# EAGLE design relay_board (EAGLE 6.6.0)
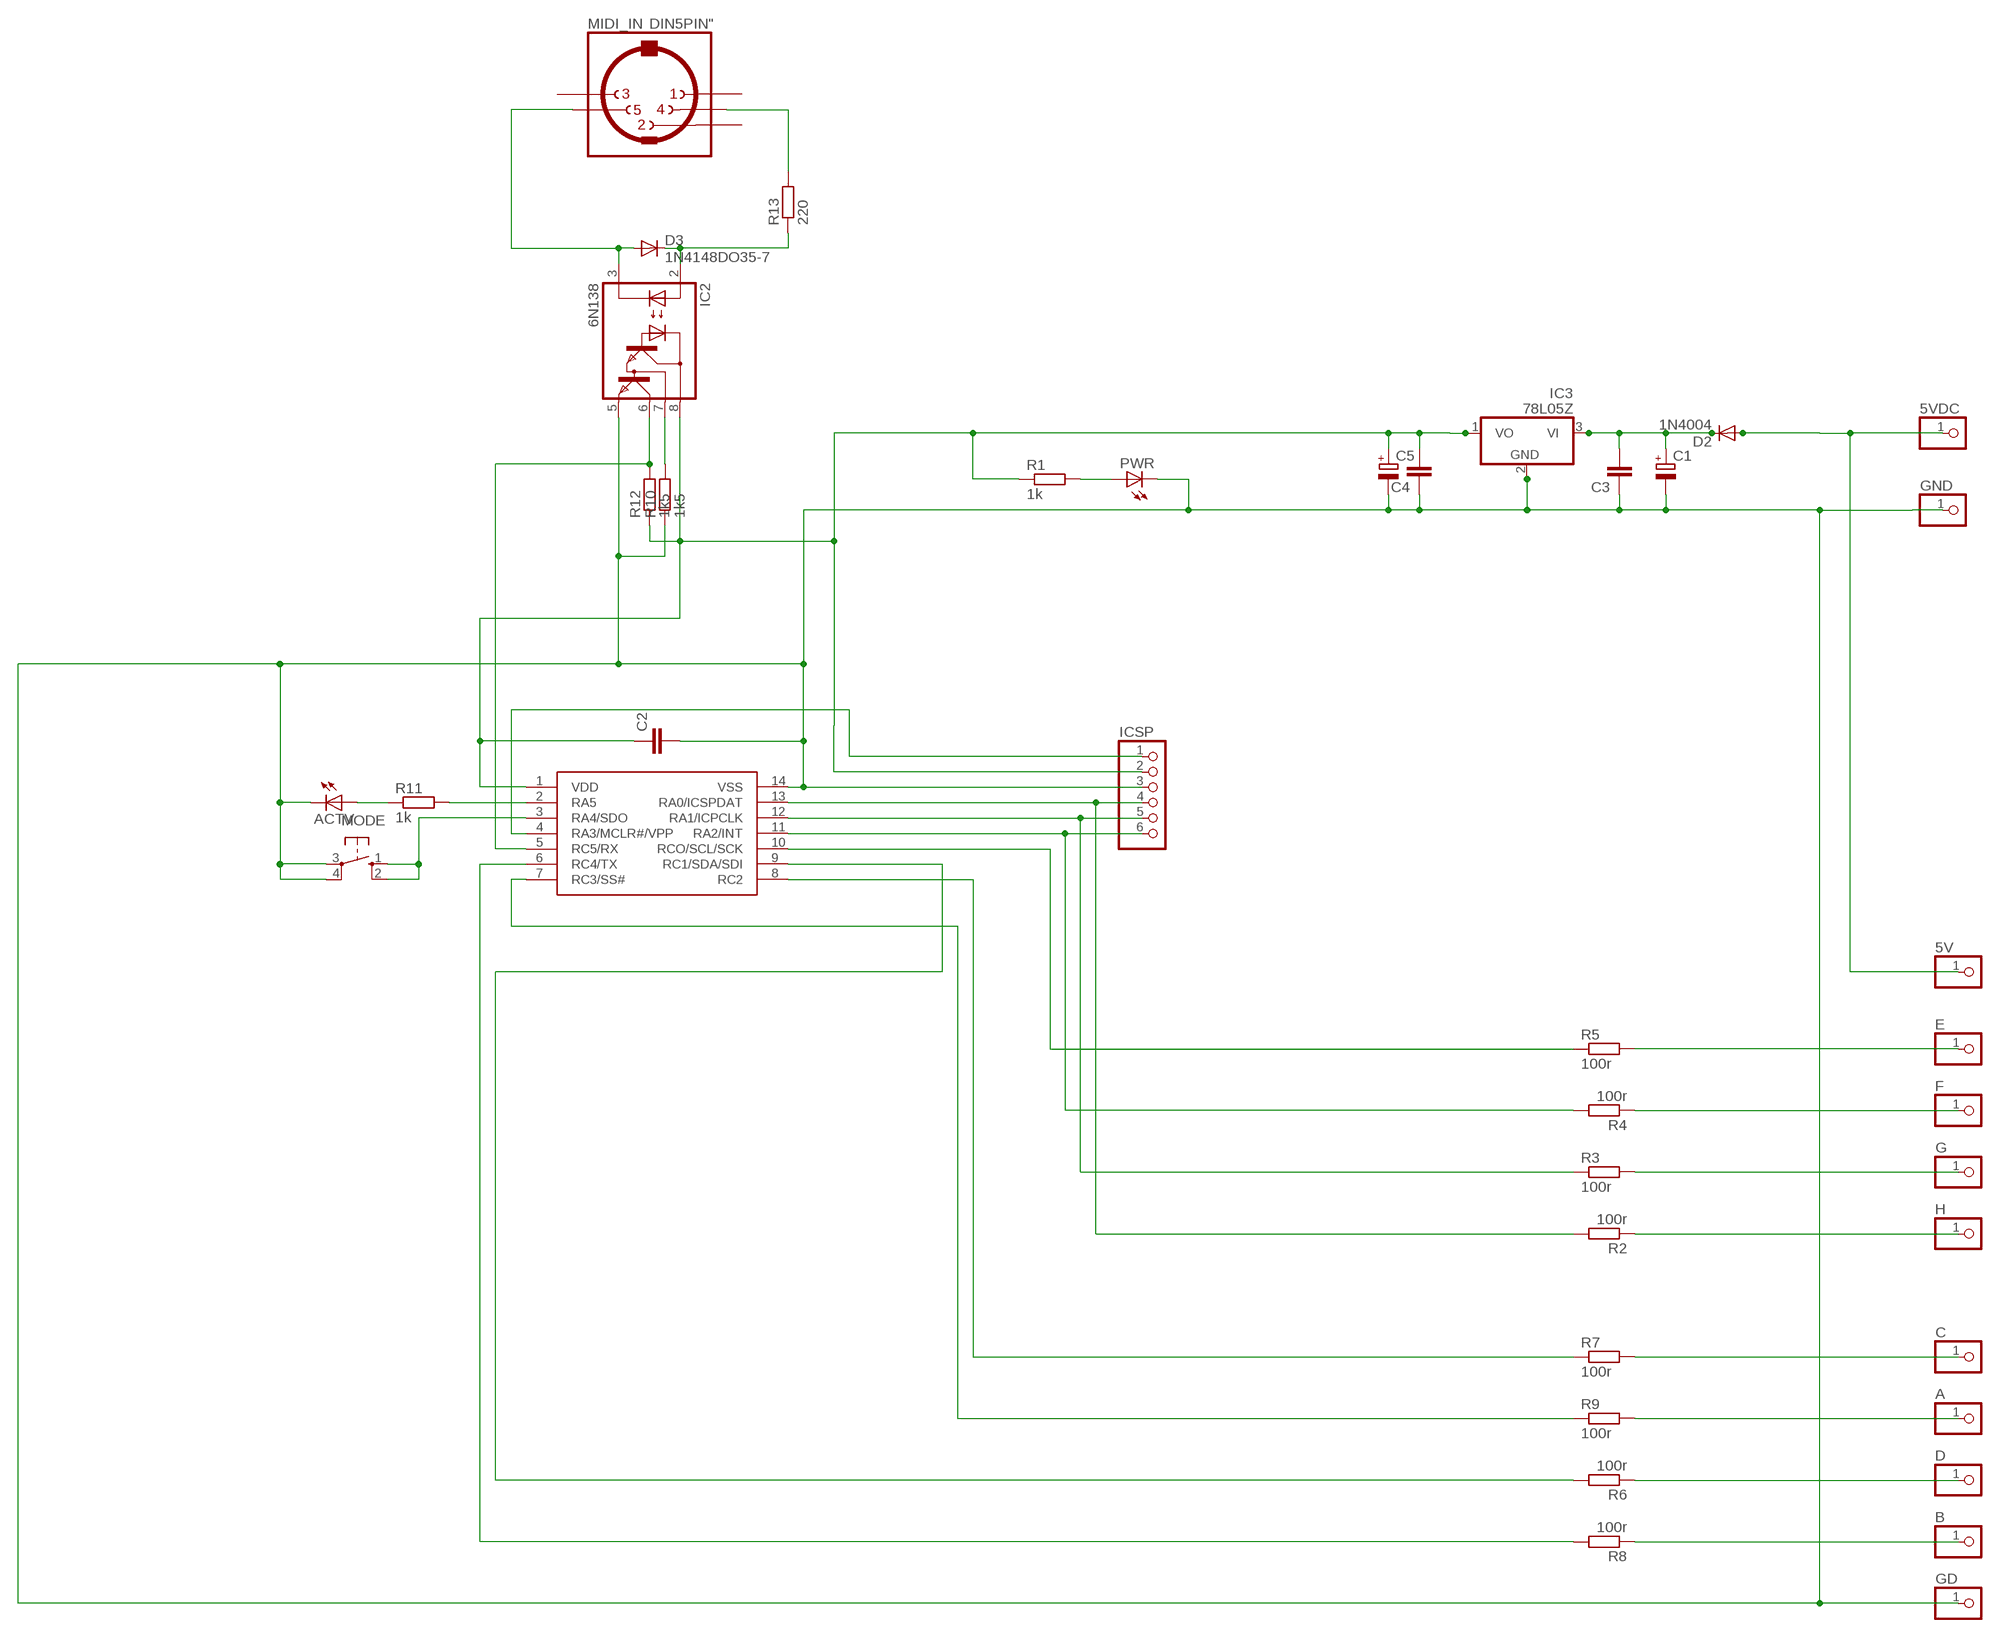
[diagram p0: schematic, sheet 1]

## Parts
5V  PINHD-1X1  [1X01]
5VDC  PINHD-1X1  [1X01]
A  PINHD-1X1  [1X01]
ACTV  LED3MM  [LED3MM]
B  PINHD-1X1  [1X01]
C  PINHD-1X1  [1X01]
C1  CPOL-EUE2.5-7  [E2,5-7]
C2  C2.5/2  [C2.5-2]
C3  C2.5/2  [C2.5-2]
C4  C2.5/2  [C2.5-2]
C5  CPOL-EUE2-5  [E2-5]
D  PINHD-1X1  [1X01]
D2  1N4004  [DO-VERT]
D3  1N4148DO35-7  [DO35-7]
E  PINHD-1X1  [1X01]
F  PINHD-1X1  [1X01]
G  PINHD-1X1  [1X01]
GD  PINHD-1X1  [1X01]
GND  PINHD-1X1  [1X01]
H  PINHD-1X1  [1X01]
IC1  PIC16F1825DIL14  [DIL14]
IC2  6N138  [DIL08]
IC3  78L05Z  [TO92]
ICSP  HEADER-1X6  [1X06_OVAL]
MIDI_IN  DIN5PIN"  [TRUCONN90]
MODE  10-XX  [B3F-10XX]
PWR  LED3MM  [LED3MM]
R1  1k  R-EU_0207/2V  [0207/2V]
R2  100r  R-EU_0207/2V  [0207/2V]
R3  100r  R-EU_0207/2V  [0207/2V]
R4  100r  R-EU_0207/2V  [0207/2V]
R5  100r  R-EU_0207/2V  [0207/2V]
R6  100r  R-EU_0207/2V  [0207/2V]
R7  100r  R-EU_0207/2V  [0207/2V]
R8  100r  R-EU_0207/2V  [0207/2V]
R9  100r  R-EU_0207/2V  [0207/2V]
R10  1k5  R-EU_0207/2V  [0207/2V]
R11  1k  R-EU_0207/2V  [0207/2V]
R12  1k5  R-EU_0207/2V  [0207/2V]
R13  220  R-EU_0207/7  [0207/7]

## Nets
3V3: C2.1 C4.2 C5.+ IC1.1(VDD) IC2.8(VCC) IC3.1(VO) ICSP.2 R1.1 R12.1
GND: ACTV.K(C) C1.- C2.2 C3.1 C4.1 C5.- GD.1 GND.1 IC1.14(VSS) IC2.5(GND) IC3.2(GND) ICSP.3 MODE.3(P) MODE.4(P1) PWR.K(C) R10.1
N$3: 5V.1 5VDC.1 D2.A
N$4: PWR.A R1.2
N$5: C1.+ C3.2 D2.C IC3.3(VI)
N$9: MIDI_IN.4 R13.2
N$10: D3.C IC2.2(A) R13.1
N$11: D3.A IC2.3(C) MIDI_IN.5
N$12: IC2.7(VB) R10.2
N$14: F.1 R4.1
N$15: G.1 R3.2
N$16: H.1 R2.1
N$17: C.1 R7.2
N$18: A.1 R9.2
N$19: D.1 R6.1
N$20: B.1 R8.1
N$21: IC1.12(RA1/ICPCLK) ICSP.5 R3.1
N$22: IC1.13(RA0/ICSPDAT) ICSP.4 R2.2
N$23: IC1.8(RC2) R7.1
N$24: IC1.7(RC3/SS#) R9.1
N$25: IC1.9(RC1/SDA/SDI) R6.2
N$26: IC1.6(RC4/TX) R8.2
N$27: E.1 R5.2
N$35: IC1.4(RA3/MCLR#/VPP) ICSP.1
N$45: IC1.3(RA4/SDO) MODE.1(S) MODE.2(S1)
N$46: IC1.11(RA2/INT) ICSP.6 R4.2
N$47: IC1.10(RCO/SCL/SCK) R5.1
N$48: IC1.5(RC5/RX) IC2.6(VO) R12.2
N$49: ACTV.A R11.1
N$50: IC1.2(RA5) R11.2
Unconnected: MIDI_IN.1 MIDI_IN.2 MIDI_IN.3

## Library data of the parts
5V 5VDC A B C D E F G GD GND H = adafruit:PINHD-1X1: Pin header 1x1 for 0.1" spacing With round pins
ACTV PWR = adafruit:LED: LED OSRAM: - CHIPLED LG R971, LG N971, LY N971, LG Q971, LY Q971, LO R971, LY R971 LH N974, LH R974 LS Q976, LO Q976, LY Q976 LO Q996 - Hyper CHIPLED LW Q18S LB Q993, LB Q99A, LB R99A - SideLED LS A670, LO A670, LY A670, LG A670, LP A670 LB A673, LV A673, LT A673, LW A673 LH A674 LY A675 LS A676, LA A676, LO A676, LY A676, LW A676 LS A679, LY A679, LG A679 - Hyper Micro SIDELED® LS Y876, LA Y876, LO Y876, LY Y876 LT Y87S - SmartLED LW L88C, LW L88S LB L89C, LB L89S, LG L890 LS L89K, LO L89K, LY L89K LS L896, LA L896, LO L896, LY L896 - TOPLED LS T670, LO T670, LY T670, LG T670, LP T670 LSG T670, LSP T670, LSY T670, LOP T670, LYG T670 LG T671, LOG T671, LSG T671 LB T673, LV T673, LT T673, LW T673 LH T674 LS T676, LA T676, LO T676, LY T676, LB T676, LH T676, LSB T676, LW T676 LB T67C, LV T67C, LT T67C, LS T67K, LO T67K, LY T67K, LW E67C LS E67B, LA E67B, LO E67B, LY E67B, LB E67C, LV E67C, LT E67C LW T67C LS T679, LY T679, LG T679 LS T770, LO T770, LY T770, LG T770, LP T770 LB T773, LV T773, LT T773, LW T773 LH T774 LS E675, LA E675, LY E675, LS T675 LS T776, LA T776, LO T776, LY T776, LB T776 LHGB T686 LT T68C, LB T68C - Hyper Mini TOPLED® LB M676 - Mini TOPLED Santana® LG M470 LS M47K, LO M47K, LY M47K Source: http://www.osram.convergy.de/
C1 C5 = rcl:CPOL-EU: POLARIZED CAPACITOR, European symbol
C2-C4 = capacitor-wima:C: CAPACITOR naming: grid - package width
D2 = jasons_stuff:1N4004: DIODE general purpose rectifier, 1 A
D3 = diode:1N4148: DIODE high speed (Philips)
IC1 = jasons_stuff:PIC16F1825
IC2 = optocoupler:6N138: MOTOROLA OPTO COUPLER
IC3 = linear:78*: Positive VOLTAGE REGULATOR Source: http://cache.national.com/ds/LM/LM78L05.pdf http://www.fairchildsemi.com/ds/LM/LM7805.pdf
ICSP = microbuilder:HEADER-1X6: PIN HEADER
MIDI_IN = jasons_stuff:DIN5PIN: Female CONNECTOR 5 pins 90 deg. with shield, horizontal (DIN 41524)
MODE = switch-omron:10-XX: OMRON SWITCH
R1-R13 = rcl:R-EU_: RESISTOR, European symbol

## Board
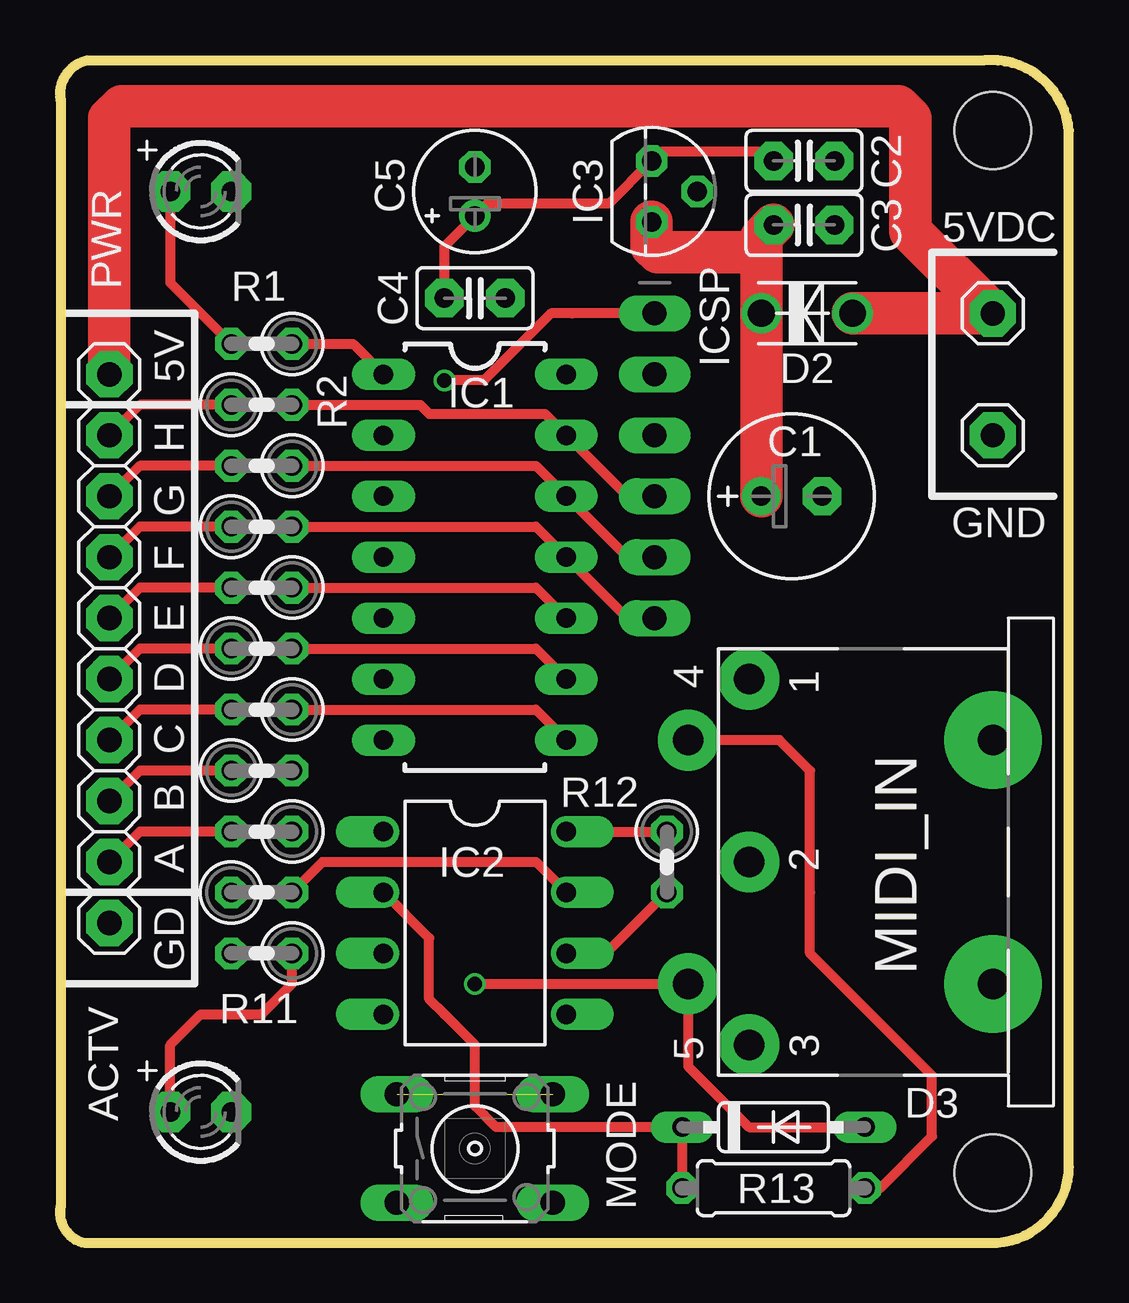
[diagram p1: board, top side]
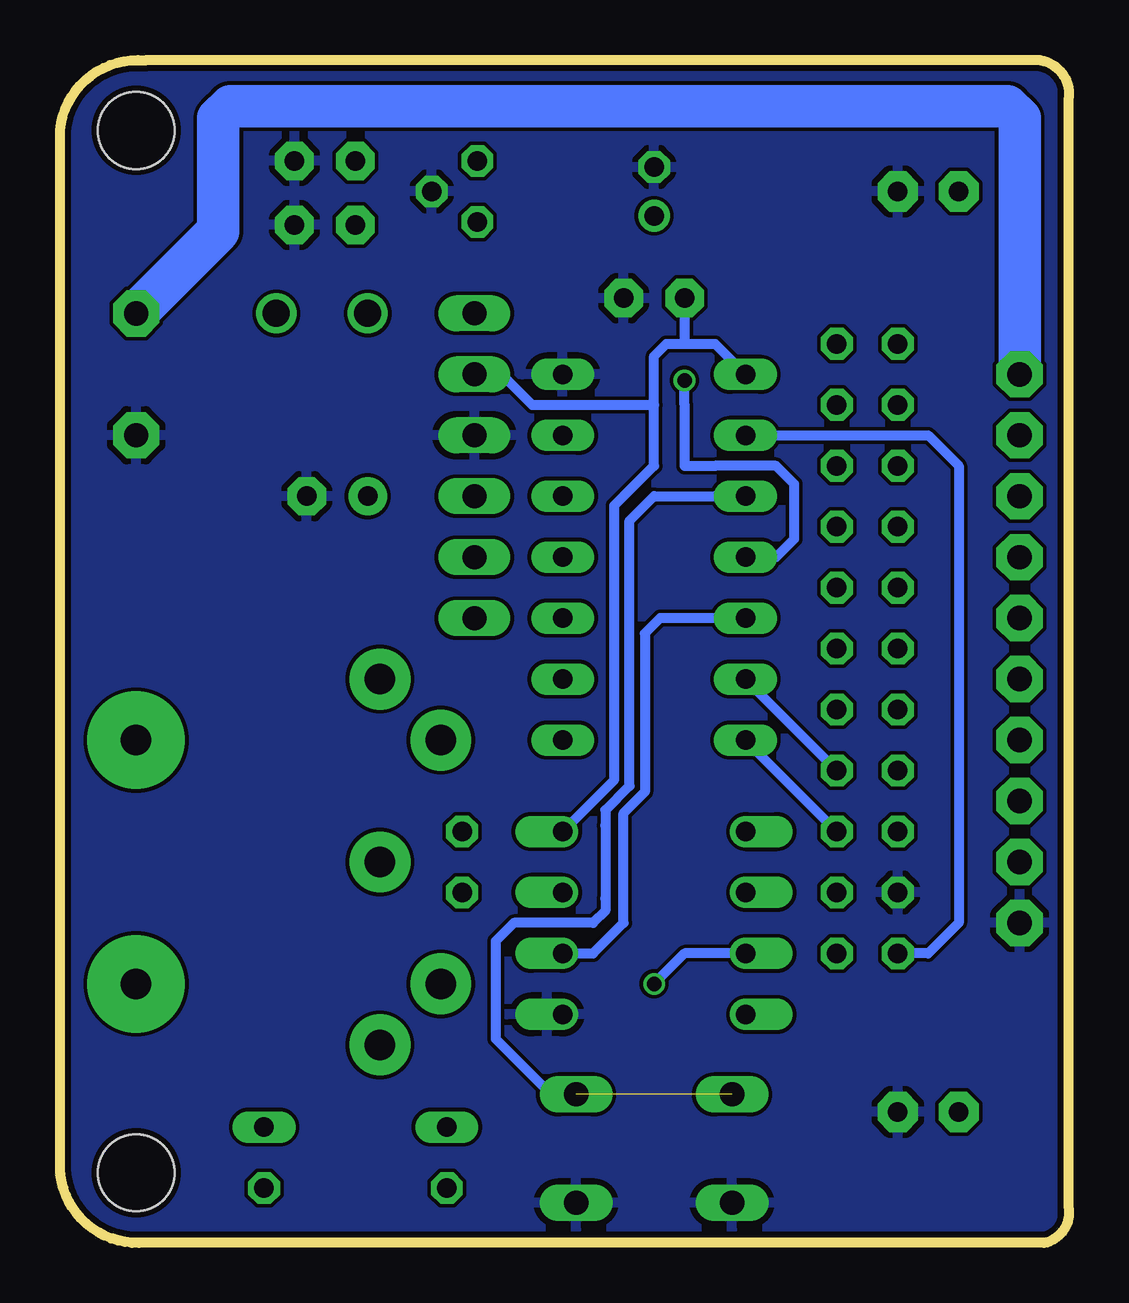
[diagram p2: board, bottom side, seen from below]

Size 42.06 x 49.29 mm. Coordinates in mm from the lower left corner, seen from the top.
Outline: 42.06,3.18 42.06,46.36 arc90 38.51,49.28 1.17,49.28 arc90 0.03,47.62 0.03,1.52 arc90 1.04,0 38.76,0 arc90 42.06,3.18
Copper layers (1*16): Top 0.035mm / dielectric 1.5mm / Bottom 0.035mm
Design rules "ITEADstudio_DRC": minimum track width 6mil, minimum drill 12mil, track to track 6mil, track to pad 6mil, pad to pad 6mil, via to via 6mil, smd to smd 0mil, copper to edge 10mil, drill to drill 10mil, minimum pad ring 10mil, minimum via ring 6mil, stop-mask expansion 2mil, vias tented up to drill 100mil, thermal gap 10mil
Holes 3.2 mm at 38.89,46.36 38.89,2.92

### Footprints (pad centres in the part's own frame; a part is rotated, then mirrored left to right if it is on the bottom)
1X01 = drill 1.016 pad 1.93 octagon: 1 0,0
LED3MM = drill 0.813 pad 1.676 octagon: A -1.27,0; K 1.27,0
E2,5-7 = drill 0.813 pad 1.6: + -1.27,0 | drill 0.813 pad 1.6 octagon: - 1.27,0
C2.5-2 = drill 0.813 pad 1.6 octagon: 1 -1.27,0; 2 1.27,0
E2-5 = drill 0.813 pad 1.27: + -1.016,0 | drill 0.813 pad 1.27 octagon: - 1.016,0
DO-VERT = drill 1.118: A 2.54,0; C -1.27,0
DO35-7 = drill 0.813 long: A 3.81,0; C -3.81,0
DIL14 = drill 0.813 long: 1 -8.89,-3.81; 2 -6.35,-3.81; 3 -3.81,-3.81; 4 -1.27,-3.81; 5 1.27,-3.81; 6 3.81,-3.81; 7 6.35,-3.81; 8 6.35,3.81; 9 3.81,3.81; 10 1.27,3.81; 11 -1.27,3.81; 12 -3.81,3.81; 13 -6.35,3.81; 14 -8.89,3.81
DIL08 = drill 0.813 offset: 1 -3.81,-3.81; 2 -1.27,-3.81; 3 1.27,-3.81; 4 3.81,-3.81; 5 3.81,3.81; 6 1.27,3.81; 7 -1.27,3.81; 8 -3.81,3.81
TO92 = drill 0.813 octagon: 1 -1.27,0; 2 0,1.905; 3 1.27,0
1X06_OVAL = drill 1 long: 1 -6.35,0; 2 -3.81,0; 3 -1.27,0; 4 1.27,0; 5 3.81,0; 6 6.35,0
TRUCONN90 = drill 1.27 pad 2.54: 1 7.62,5.08; 2 0,5.08; 3 -7.62,5.08; 4 5.08,7.62; 5 -5.08,7.62 | drill 1.27 pad 4.064: NC -5.08,-5.08; NC@ 5.08,-5.08
B3F-10XX = drill 1.016 long: 1 -3.251,2.261; 2 3.251,2.261; 3 -3.251,-2.261; 4 3.251,-2.261
0207/2V = drill 0.813 octagon: 1 -1.27,0; 2 1.27,0
0207/7 = drill 0.813 octagon: 1 -3.81,0; 2 3.81,0

### Placement (x,y rotation side)
5V  2.06,36.2 0 top
5VDC  38.89,38.73 0 top
A  2.06,15.88 0 top
ACTV  5.87,5.46 0 top
B  2.06,18.42 0 top
C  2.06,20.96 0 top
C1  30.51,31.11 0 top
C2  31.01,45.09 0 top
C3  31.01,42.42 180 top
C4  17.3,39.37 180 top
C5  17.3,43.82 90 top
D  2.06,23.5 0 top
D2  30.51,38.73 0 top
D3  29.74,4.83 0 top
E  2.06,26.04 0 top
F  2.06,28.57 0 top
G  2.06,31.11 0 top
GD  2.06,13.34 0 top
GND  38.89,33.66 0 top
H  2.06,33.66 0 top
IC1  17.3,27.31 270 top
IC2  17.3,13.34 270 top
IC3  24.66,43.82 270 top
ICSP  24.79,32.39 270 top
MIDI_IN  33.81,15.88 90 top
MODE  17.3,3.94 0 top
PWR  5.87,43.82 0 top
R1  8.41,37.47 180 top
R2  8.41,34.93 0 top
R3  8.41,32.39 180 top
R4  8.41,29.85 0 top
R5  8.41,27.31 180 top
R6  8.41,24.77 0 top
R7  8.41,22.23 180 top
R8  8.41,19.68 0 top
R9  8.41,17.14 180 top
R10  8.41,14.61 0 top
R11  8.41,12.07 180 top
R12  25.3,15.88 270 top
R13  29.74,2.29 0 top

### Tracks (layer width: path | path; a pad name or v marks a point on that pad's centre or on a via)
3V3
  Top 0.406: R1.1 12.22,37.47 IC1.1 | C2.1 29.36,45.47 25.04,45.47 IC3.1 22.89,43.31 17.81,43.31 C5.+ 16.03,41.53 C4.2 | IC2.8 R12.1
  Top 0.813: 17.04,42.8 C5.+
  Bottom 0.406: 16.03,37.47 16.15,37.47 16.79,37.47 17.3,36.96 17.3,34.93 | IC2.8 19.84,18.42 18.95,19.3 18.95,30.73 17.3,32.39 17.3,34.93 | ICSP.2 23.65,36.2 22.38,34.93 18.95,34.93 17.3,34.93 | 16.03,37.47 14.76,37.47 IC1.1 | C4.2 16.03,37.47
GND
  pour Bottom: -4.29,55.25 -4.29,-5.71 43.97,-5.71 43.97,57.79 -4.29,57.79
N$3
  Top 1.778: 5V.1 2.06,46.86 2.57,47.37 34.95,47.37 35.46,46.86 35.46,42.16 5VDC.1 D2.A
  Bottom 1.778: 5V.1 2.06,46.86 2.57,47.37 34.95,47.37 35.46,46.86 35.46,42.16 5VDC.1
N$4
  Top 0.406: PWR.A 4.6,40.01 R1.2
N$5
  Top 1.778: 29.24,41.28 D2.C 29.24,31.24 C1.+ | 29.24,41.28 29.24,41.91 C3.2 | IC3.3 24.66,41.53 24.92,41.28 29.24,41.28
N$9
  Top 0.406: MIDI_IN.4 30,20.96 31.27,19.68 31.27,14.61 31.27,12.07 36.35,6.99 36.35,4.45 34.19,2.29 R13.2
N$10
  Top 0.406: R13.1 D3.C 18.19,4.83 17.3,5.71 17.3,8.25 16.03,9.53 15.39,10.16 15.39,12.7 IC2.2
N$11  (via drill 0.6)
  Top 0.406: D3.A 28.73,4.83 26.19,7.37 MIDI_IN.5 v17.3,10.79
  Bottom 0.406: IC2.3 16.03,12.07 v17.3,10.79
N$12
  Top 0.406: R10.2 10.95,15.88 19.84,15.88 IC2.7
N$14
  Top 0.406: R4.1 3.33,29.85 F.1
N$15
  Top 0.406: R3.2 3.33,32.39 G.1
N$16
  Top 0.406: R2.1 3.33,34.93 H.1
N$17
  Top 0.406: R7.2 3.33,22.23 C.1
N$18
  Top 0.406: R9.2 3.33,17.14 A.1
N$19
  Top 0.406: R6.1 3.33,24.77 D.1
N$20
  Top 0.406: R8.1 3.33,19.68 B.1
N$21
  Top 0.406: R3.1 19.84,32.39 IC1.12 23.65,28.57 ICSP.5
N$22
  Top 0.406: ICSP.4 23.65,31.11 IC1.13 20.22,34.54 15.39,34.54 15.01,34.93 R2.2
N$23
  Top 0.406: R7.1 19.84,22.23 IC1.8
N$24
  Bottom 0.406: R9.1 IC1.7
N$25
  Top 0.406: R6.2 19.84,24.77 IC1.9
N$26
  Bottom 0.406: R8.2 IC1.6
N$27
  Top 0.406: R5.2 3.33,27.31 E.1
N$35  (via drill 0.6)
  Top 0.406: ICSP.1 21.36,38.73 20.47,38.73 17.68,35.94 v16.03,35.94
  Bottom 0.406: IC1.4 12.22,28.57 11.46,29.34 11.46,31.62 12.22,32.39 14.76,32.39 16.03,32.39 16.03,34.93 v16.03,35.94
N$45  (1 unrouted)
  Bottom 0.406: 14.76,31.11 IC1.3 17.3,31.11 18.31,30.1 18.31,19.05 19.33,18.03 19.33,17.4 19.33,14.35 19.33,13.84 19.84,13.34 23.14,13.34 23.9,12.57 23.9,8.51 22.38,6.99 21.59,6.2 MODE.2
N$46
  Top 0.406: R4.2 19.84,29.85 IC1.11 23.65,26.04 ICSP.6
N$47
  Top 0.406: R5.1 19.84,27.31 IC1.10
N$48
  Top 0.406: R12.2 23.39,12.7 22.76,12.07 IC2.6
  Bottom 0.406: IC2.6 19.84,12.07 18.57,13.34 18.57,17.91 17.68,18.8 17.68,25.4 17.04,26.04 16.28,26.04 IC1.5
N$49
  Top 0.406: ACTV.A 4.6,8.25 5.87,9.53 8.41,9.53 9.68,10.79 R11.1
N$50
  Bottom 0.406: IC1.2 5.87,33.66 4.6,32.39 4.6,13.34 5.87,12.07 R11.2

### Text on the board
tDocu: RELAY SWITCHER | RELAY SWITCHER | rev 2 | hotchk155